# Altium schematic sheet POWER.SchDoc: POWER
size A4; DrawnBy: nand; DocumentNumber: 1; Revision: V0.1; SheetNumber: 2; SheetTotal: 13
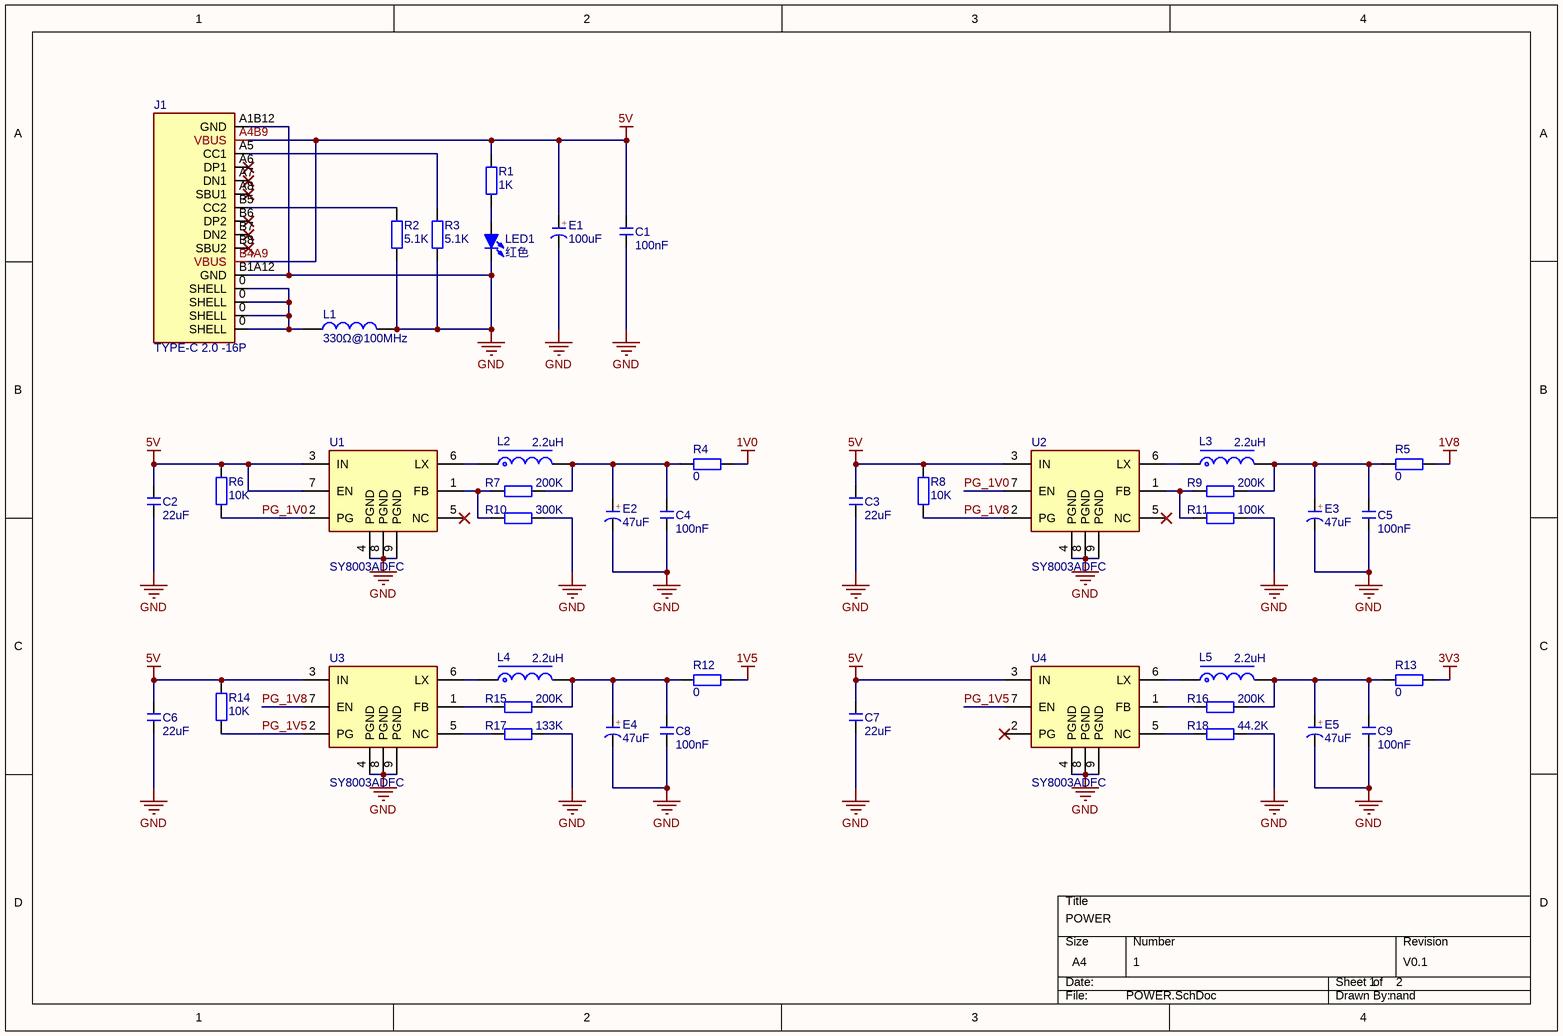
[diagram p0: POWER.SchDoc]

## Parts
C1  100nF  [C 0402_L]
C2  22uF  [C 0805_L]
C3  22uF  [C 0805_L]
C4  100nF  [C 0402_L]
C5  100nF  [C 0402_L]
C6  22uF  [C 0805_L]
C7  22uF  [C 0805_L]
C8  100nF  [C 0402_L]
C9  100nF  [C 0402_L]
E1  100uF  [CD A(3216)]
E2  47uF  [CD A(3216)]
E3  47uF  [CD A(3216)]
E4  47uF  [CD A(3216)]
E5  47uF  [CD A(3216)]
J1  TYPE-C 2.0 -16P  [USB-C-SMD_16P]
L1  330Ω@100MHz  [L 0805]
L2  2.2uH  [CD52]
L3  2.2uH  [CD52]
L4  2.2uH  [CD52]
L5  2.2uH  [CD52]
LED1  红色  [LED 0805G]
R1  1K  [R 0402_L]
R2  5.1K  [R 0402_L]
R3  5.1K  [R 0402_L]
R4  0  [R 0603_L]
R5  0  [R 0603_L]
R6  10K  [R 0402_L]
R7  200K  [R 0805_L]
R8  10K  [R 0402_L]
R9  200K  [R 0805_L]
R10  300K  [R 0805_L]
R11  100K  [R 0805_L]
R12  0  [R 0603_L]
R13  0  [R 0603_L]
R14  10K  [R 0402_L]
R15  200K  [R 0805_L]
R16  200K  [R 0805_L]
R17  133K  [R 0805_L]
R18  44.2K  [R 0805_L]
U1  SY8003ADFC  [SON50P200X200X65-9N]
U2  SY8003ADFC  [SON50P200X200X65-9N]
U3  SY8003ADFC  [SON50P200X200X65-9N]
U4  SY8003ADFC  [SON50P200X200X65-9N]

## Nets
1V0: R4.1
1V5: R12.1
1V8: R5.1
3V3: R13.1
5V: C1.2 C2.2 C3.2 C6.2 C7.2 E1.1(A) J1.A4B9(VBUS) J1.B4A9(VBUS) R1.2 R6.2 R8.2 R14.2 U1.3(IN) U1.7(EN) U2.3(IN) U3.3(IN) U4.3(IN)
GND: C1.1 C2.1 C3.1 C4.1 C5.1 C6.1 C7.1 C8.1 C9.1 E1.2(K) E2.2(K) E3.2(K) E4.2(K) E5.2(K) J1.A1B12(GND) J1.B1A12(GND) L1.2 LED1.2(K) R2.1 R3.1 R10.1 R11.1 R17.1 R18.1 U1.4(PGND) U1.8(PGND) U1.9(PGND) U2.4(PGND) U2.8(PGND) U2.9(PGND) U3.4(PGND) U3.8(PGND) U3.9(PGND) U4.4(PGND) U4.8(PGND) U4.9(PGND)
PG_1V0: R6.1 U1.2(PG) U2.7(EN)
PG_1V5: R14.1 U3.2(PG) U4.7(EN)
PG_1V8: R8.1 U2.2(PG) U3.7(EN)
NetC4_2: C4.2 E2.1(A) L2.2 R4.2 R7.1
NetC5_2: C5.2 E3.1(A) L3.2 R5.2 R9.1
NetC8_2: C8.2 E4.1(A) L4.2 R12.2 R15.1
NetC9_2: C9.2 E5.1(A) L5.2 R13.2 R16.1
NetJ1_0: J1.0(SHELL) L1.1
NetJ1_A5: J1.A5(CC1) R3.2
NetJ1_B5: J1.B5(CC2) R2.2
NetL2_1: L2.1 U1.6(LX)
NetL3_1: L3.1 U2.6(LX)
NetL4_1: L4.1 U3.6(LX)
NetL5_1: L5.1 U4.6(LX)
NetLED1_1: LED1.1(A) R1.1
NetR7_2: R7.2 R10.2 U1.1(FB)
NetR9_2: R9.2 R11.2 U2.1(FB)
NetR15_2: R15.2 U3.1(FB)
NetR16_2: R16.2 U4.1(FB)
NetR17_2: R17.2 U3.5(NC)
NetR18_2: R18.2 U4.5(NC)

Not connected (* = marked no-connect by the designer): J1 A6(DP1)* A7(DN1)* A8(SBU1)* B6(DP2)* B7(DN2)* B8(SBU2)*; U1 5(NC)*; U2 5(NC)*; U4 2(PG)*

## Notes on the sheet
- (in symbol C-CD) +

## Library data of the parts
C1-C9 = C: 无极性贴片电容; 版权归属: 源创客; BOM名称: 无极性贴片电容; 学习资源: www.ooocke.com
E1-E5 = C-CD: 贴片钽电容; 版权归属: 源创客; BOM名称: 贴片钽电容; 学习资源: www.ooocke.com
J1 = USB2.0_Type-C_16Pin: USB2.0_Type-C_16Pin母座; 联系卖家 免费技术支持: 封装库来自淘宝卖家ID：黄晶宝石
L1 = L: 小功率贴片电感; 版权归属: 源创客; BOM名称: 小功率贴片电感; 学习资源: www.ooocke.com
L2-L5 = L-CD: 贴片功率电感; BOM名称: 功率电感; 版权归属: 源创客; 学习资源: www.ooocke.com
LED1 = LED-SMD: 贴片LED; 版权归属: 源创客; BOM名称: 贴片LED; 学习资源: www.ooocke.com
R1-R18 = R: 贴片电阻; 版权归属: 源创客; BOM名称: 贴片电阻; 学习资源: www.ooocke.com
U1-U4 = SY8003ADFC: 开关电源; Manufacturer_Name: Silergy; Datasheet Link: https://datasheet.lcsc.com/lcsc/1808011444_Silergy-Corp-SY8003ADFC_C178236.pdf; Height: 0.65mm; Manufacturer_Part_Number: SY8003ADFC